# Altium project Mach3led.PrjPCB
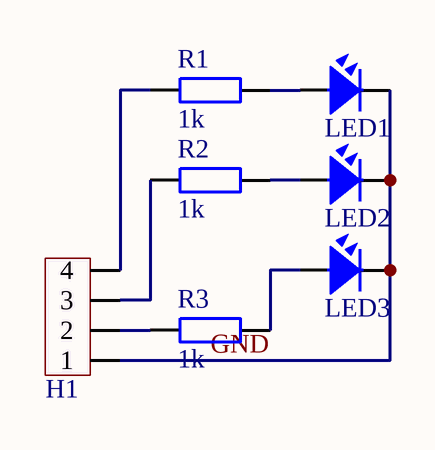
[diagram p0: Mach3led.SchDoc]
1 sheet, 7 parts. Net scope: global (net labels, ports and power ports of the same name join across sheets).
Board file: Mach3led.PcbDoc

## Sheet Mach3led.SchDoc
size A3

### Parts
H1  Header4  [Header4]  (value not drawn)
LED1  LED  [LED-3]  (value not drawn)
LED2  LED  [LED-3]  (value not drawn)
LED3  LED  [LED-3]  (value not drawn)
R1  1k  [R1/4W]
R2  1k  [R1/4W]
R3  1k  [R1/4W]

### Nets
GND: H1.1 LED1.2 LED2.2 LED3.2
NetH1_2: H1.2 R3.1
NetH1_3: H1.3 R2.1
NetH1_4: H1.4 R1.1
NetLED1_1: LED1.1 R1.2
NetLED2_1: LED2.1 R2.2
NetLED3_1: LED3.1 R3.2

### Library data of the parts
H1 = Header4: Header IDC, 4 x 1 Pin Vertical 2.54mm Pitch (Non-Boxed, Male)
LED1-LED3 = LED: LED Single colour Green and Red; Value: LED 3 ly Single Colour
R1-R3 = R1/4W: Resistor 1/4W; Value: R1/4W - 1K